# EAGLE design Controlador de temperatura (EAGLE 9.6.2)
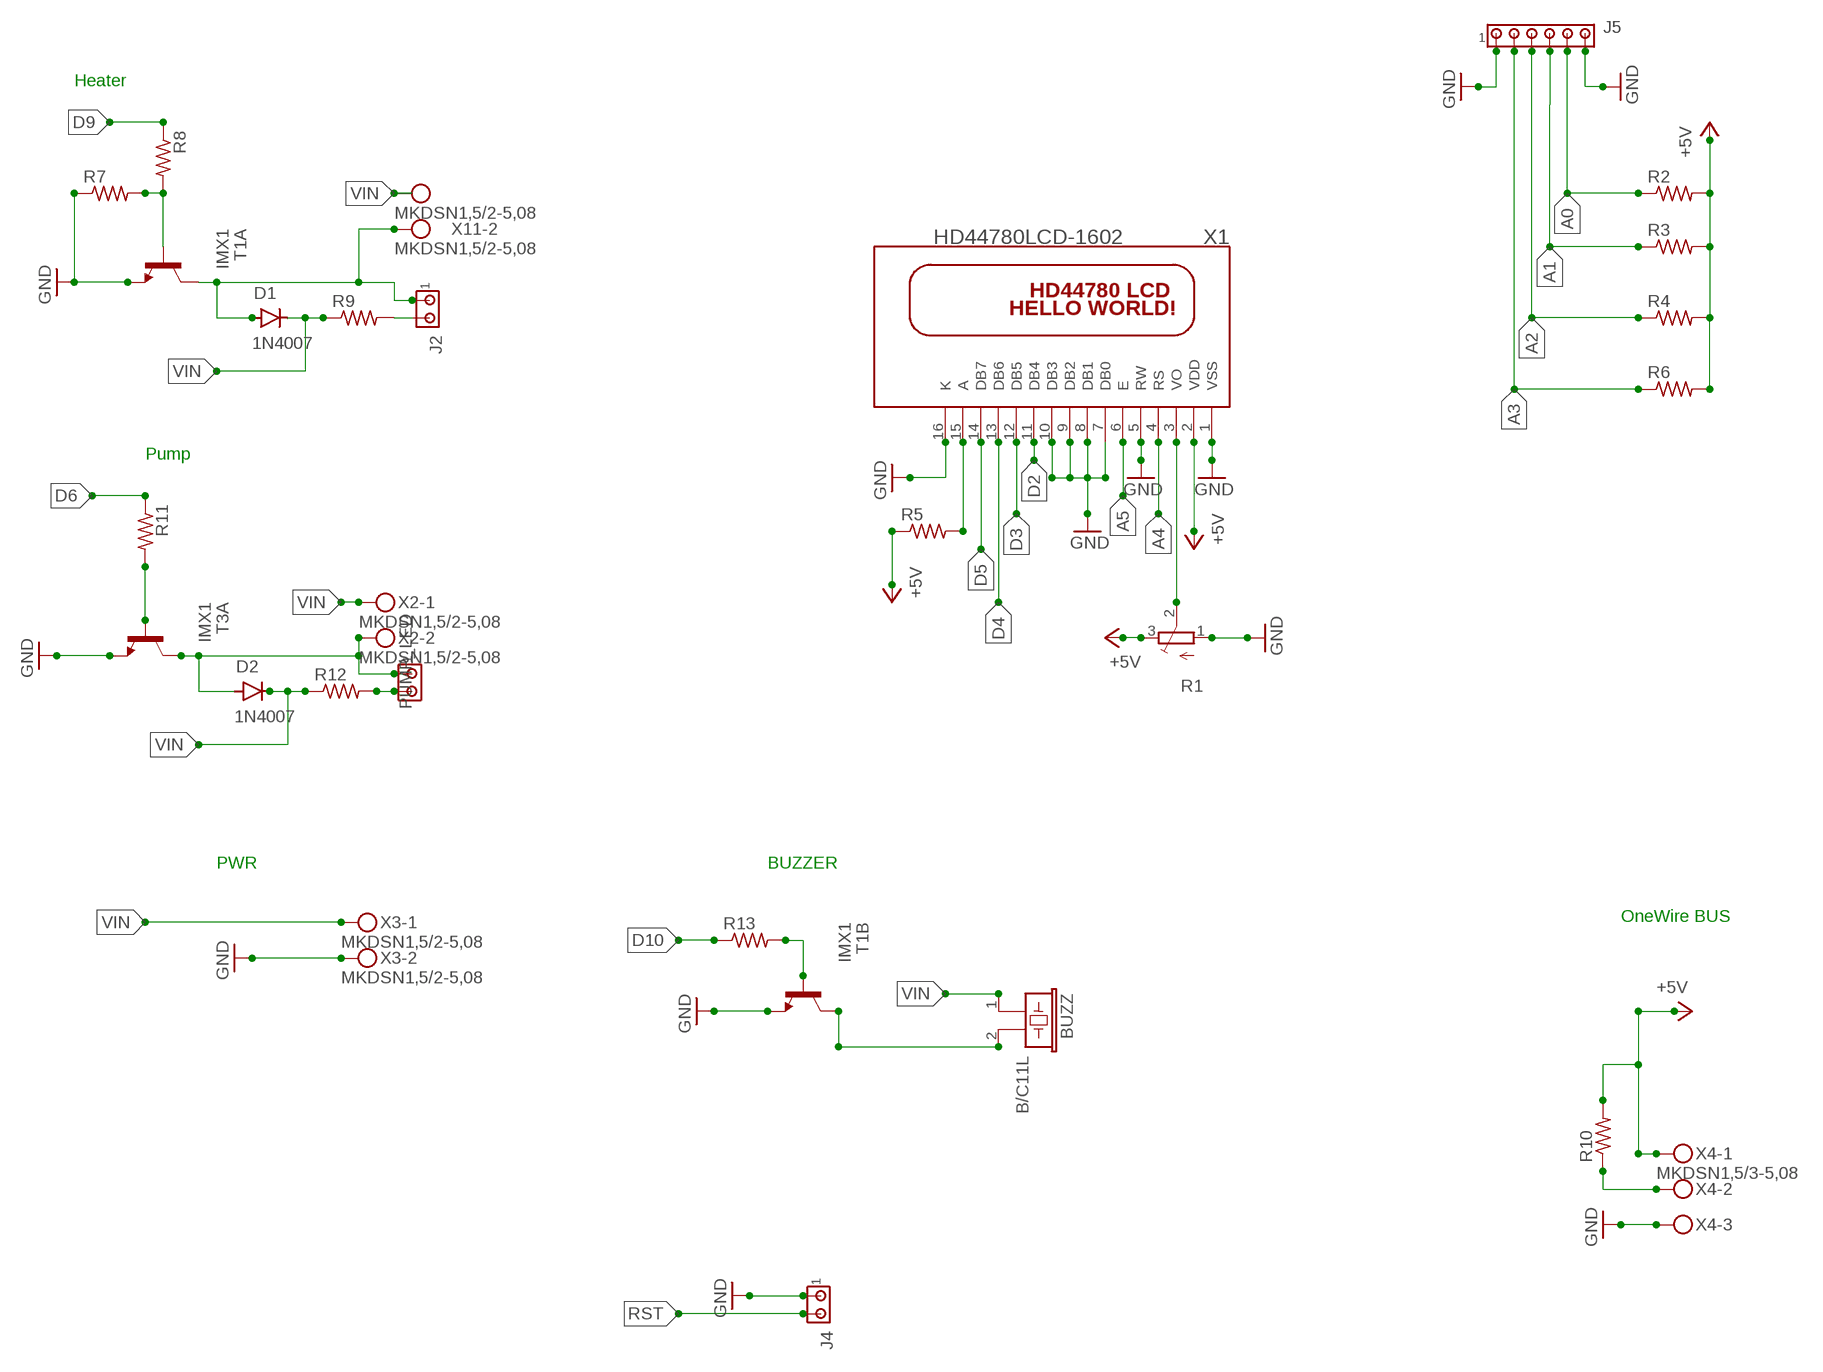
[diagram p0: schematic, sheet 1]

## Parts
BUZZ  B/C11L  [B/C11L]
D1  1N4007  [DO-41]
D2  1N4007  [DO-41]
J2  MTA02-156  [1X2MTA]
J4  MTA02-156  [1X2MTA]
J5  MTA06-100  [10X06MTA]
PUMP_LED  MTA02-156  [1X2MTA]
R1  TRIM_EU-3223W  [3223W]
R2  R-US_0204/7  [0204/7]
R3  R-US_0204/7  [0204/7]
R4  R-US_0204/7  [0204/7]
R5  R-US_0204/7  [0204/7]
R6  R-US_0204/7  [0204/7]
R7  R-US_0204/7  [0204/7]
R8  R-US_0204/7  [0204/7]
R9  R-US_0204/7  [0204/7]
R10  R-US_0204/7  [0204/7]
R11  R-US_0204/7  [0204/7]
R12  R-US_0204/7  [0204/7]
R13  R-US_0204/7  [0204/7]
T1  IMX1  [SMT6]
T3  IMX1  [SMT6]
X1  HD44780LCD-1602  [LCD1602]
X2  MKDSN1,5/2-5,08  [MKDSN1,5/2-5,08]
X3  MKDSN1,5/2-5,08  [MKDSN1,5/2-5,08]
X4  MKDSN1,5/3-5,08  [MKDSN1,5/3-5,08]
X11  MKDSN1,5/2-5,08  [MKDSN1,5/2-5,08]

## Nets
+5V: R1.3(E) R2.2 R3.2 R4.2 R5.1 R6.2 R10.2 X1.2(VDD) X4.1
A0: J5.5 R2.1
A1: J5.4 R3.1
A2: J5.3 R4.1
A3: J5.2 R6.1
A4: X1.4(RS)
A5: X1.6(E)
D2: X1.11(DB4)
D3: X1.12(DB5)
D4: X1.13(DB6)
D5: X1.14(DB7)
D6: R11.1
D9: R8.1
D10: R13.1
GND: J4.1 J5.1 J5.6 R1.1(A) R7.1 T1.3(B:E) T1.6(A:E) T3.6(A:E) X1.1(VSS) X1.5(RW) X1.7(DB0) X1.8(DB1) X1.9(DB2) X1.10(DB3) X1.16(K) X3.2 X4.3
N$1: R5.2 X1.15(A)
N$2: BUZZ.2 T1.4(B:C)
N$8: R1.2(S) X1.3(VO)
N$13: D1.A J2.1 T1.1(A:C) X11.2
N$14: R7.2 R8.2 T1.5(A:B)
N$17: D2.A PUMP_LED.1 T3.1(A:C) X2.2
N$18: R11.2 T3.5(A:B)
N$19: J2.2 R9.2
N$20: PUMP_LED.2 R12.2
N$22: R10.1 X4.2
N$24: R13.2 T1.2(B:B)
RST: J4.2
VIN: BUZZ.1 D1.C D2.C R9.1 R12.1 X2.1 X3.1 X11.1
Unconnected: T3.2(B:B) T3.3(B:E) T3.4(B:C)

## Notes on the sheet
- Heater
- Pump
- PWR | BUZZER
- OneWire BUS

## Library data of the parts
BUZZ = buzzer:B/C11L: BUZZER Source: Buerklin; OC_FARNELL: unknown; OC_NEWARK: unknown
D1 D2 = Diodes:1N4007: DIODE GEN PURP 1KV 1A DO41 Manufacturer's datasheet <https://www.mccsemi.com/pdf/Products/1N4001-1N4007(DO-41).pdf>; CREATED_BY: PCBLayout.com; DIGIKEY_PART_NUMBER: 1N4007MSCT-ND; MANUFACTURER: Micro Commercial Co; MPN: 1N4007; PACKAGE: DO-41
J2 J4 PUMP_LED = con-amp:MTA02-156: AMP connector
J5 = con-amp:MTA06-100: AMP connector Connection corrected 2014-09-19
R1 = pot:TRIM_EU-: POTENTIOMETER
R2-R13 = rcl:R-US_: RESISTOR, American symbol; SPICEPREFIX: R
T1 T3 = rohm:IMX1: General purpose transistors (dual transistors) Two 2SC2412K chips in a EMT or UMT or SMT package. Source: http://www.rohm.com/products/databook/tr/pdf/umx1n.pdf; MPN: IMX1T110; OC_FARNELL: 1680348; OC_NEWARK: 74M2434
X1 = adafruit:HD44780LCD: HD44780 LCD Standard character type LCDs, available in sizes from 8x1 to 40x4!
X2 X3 X11 = con-phoenix-508:MKDSN1,5/2-5,08: MKDSN 1,5/ 2-5,08 Printklemme Nennstrom: 13,5 A Nennspannung: 250 V Rastermaß: 5,08 mm Polzahl: 2 Anschlussart: Schraubanschluss Montage: Löten Anschlussrichtung Leiter/Platine: 0 ° Artikelnummer: 1729128 Source: http://eshop.phoenixcontact.com .. 1729128.pdf
X4 = con-phoenix-508:MKDSN1,5/3-5,08: MKDSN 1,5/ 3-5,08 Printklemme Nennstrom: 13,5 A Nennspannung: 250 V Rastermaß: 5,08 mm Polzahl: 3 Anschlussart: Schraubanschluss Montage: Löten Anschlussrichtung Leiter/Platine: 0 ° Artikelnummer: 1729131 Source: http://eshop.phoenixcontact.com .. 1729131.pdf

## Board
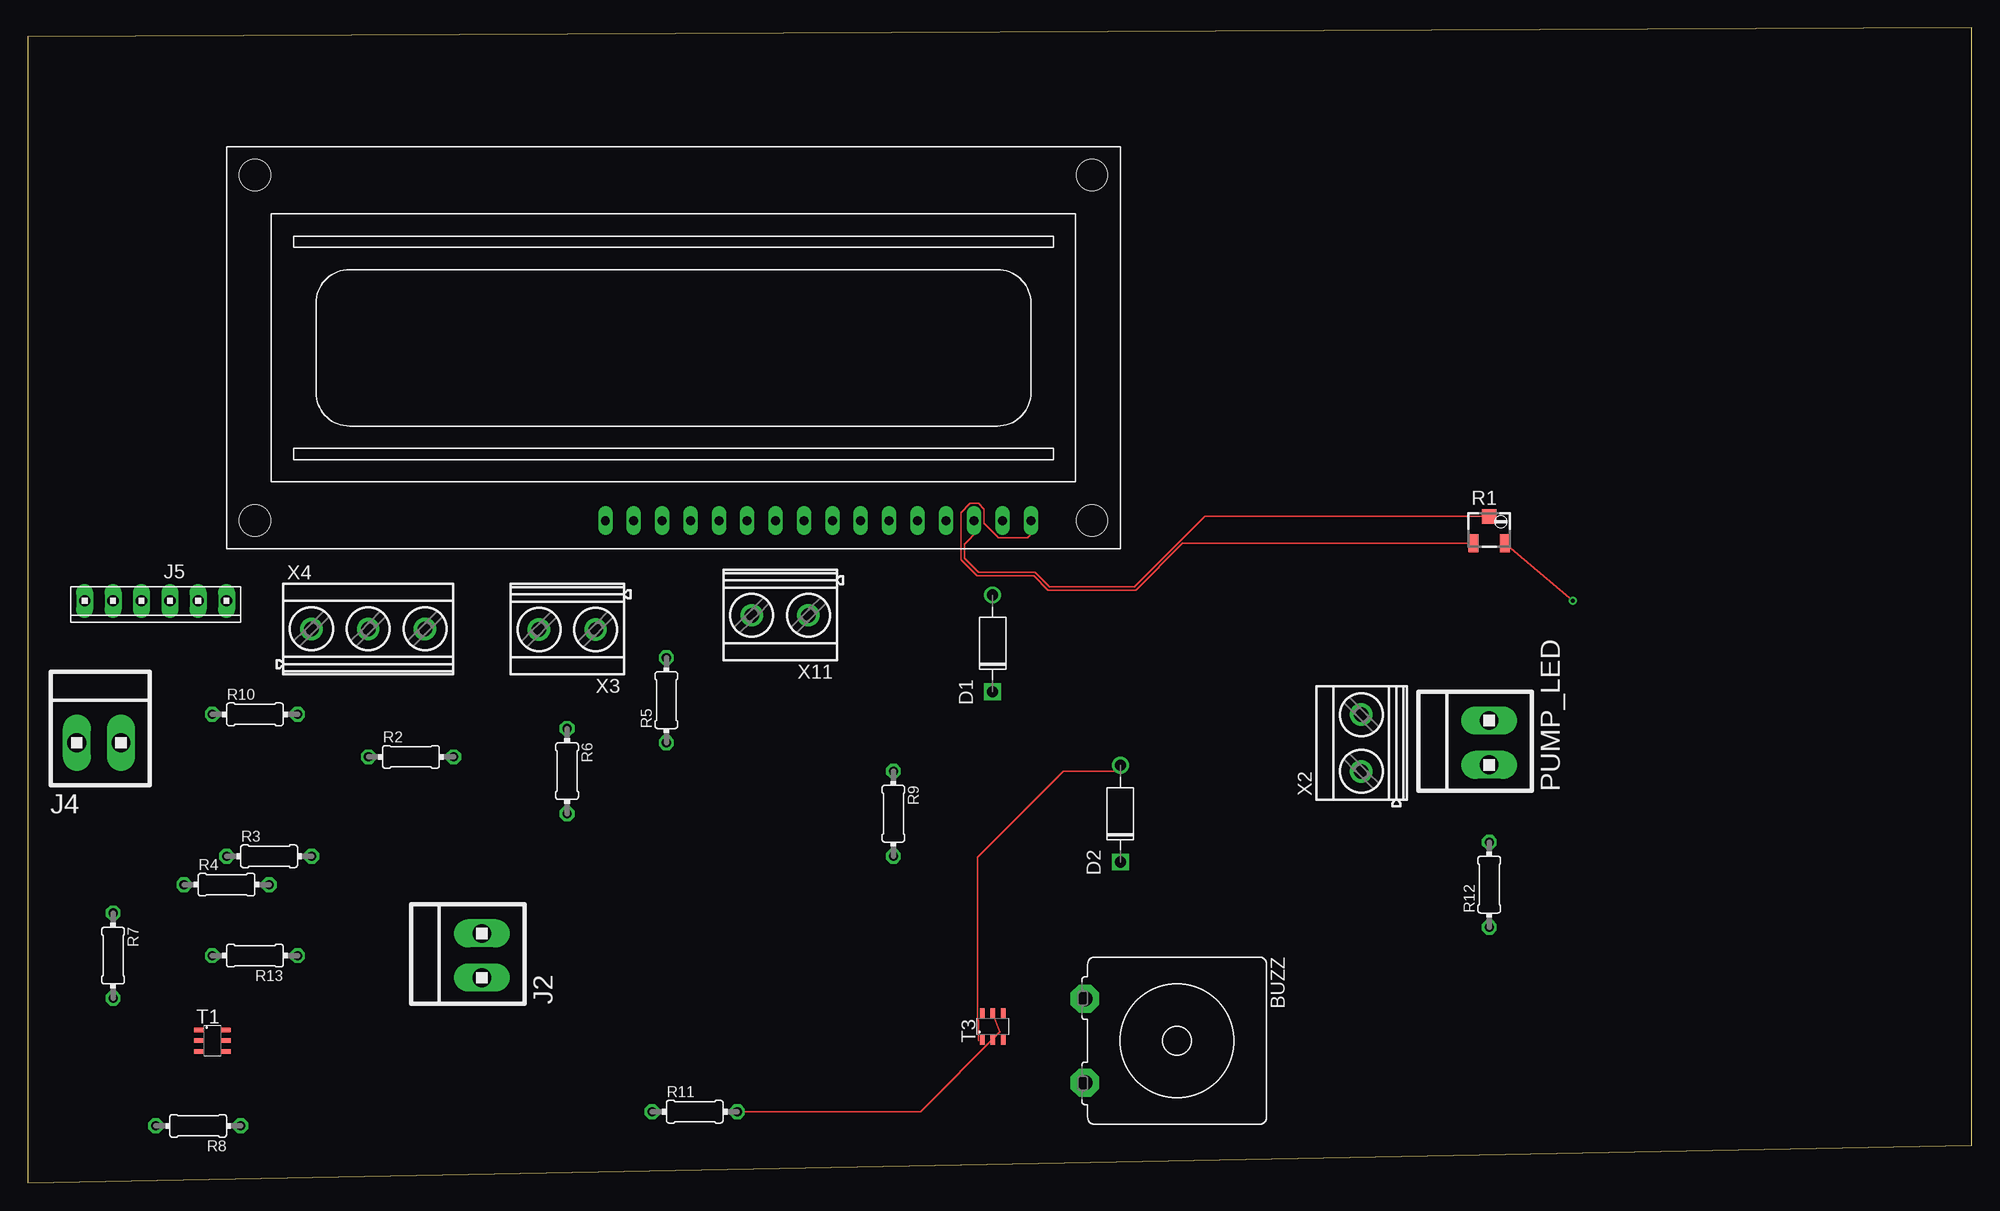
[diagram p1: board, top side]
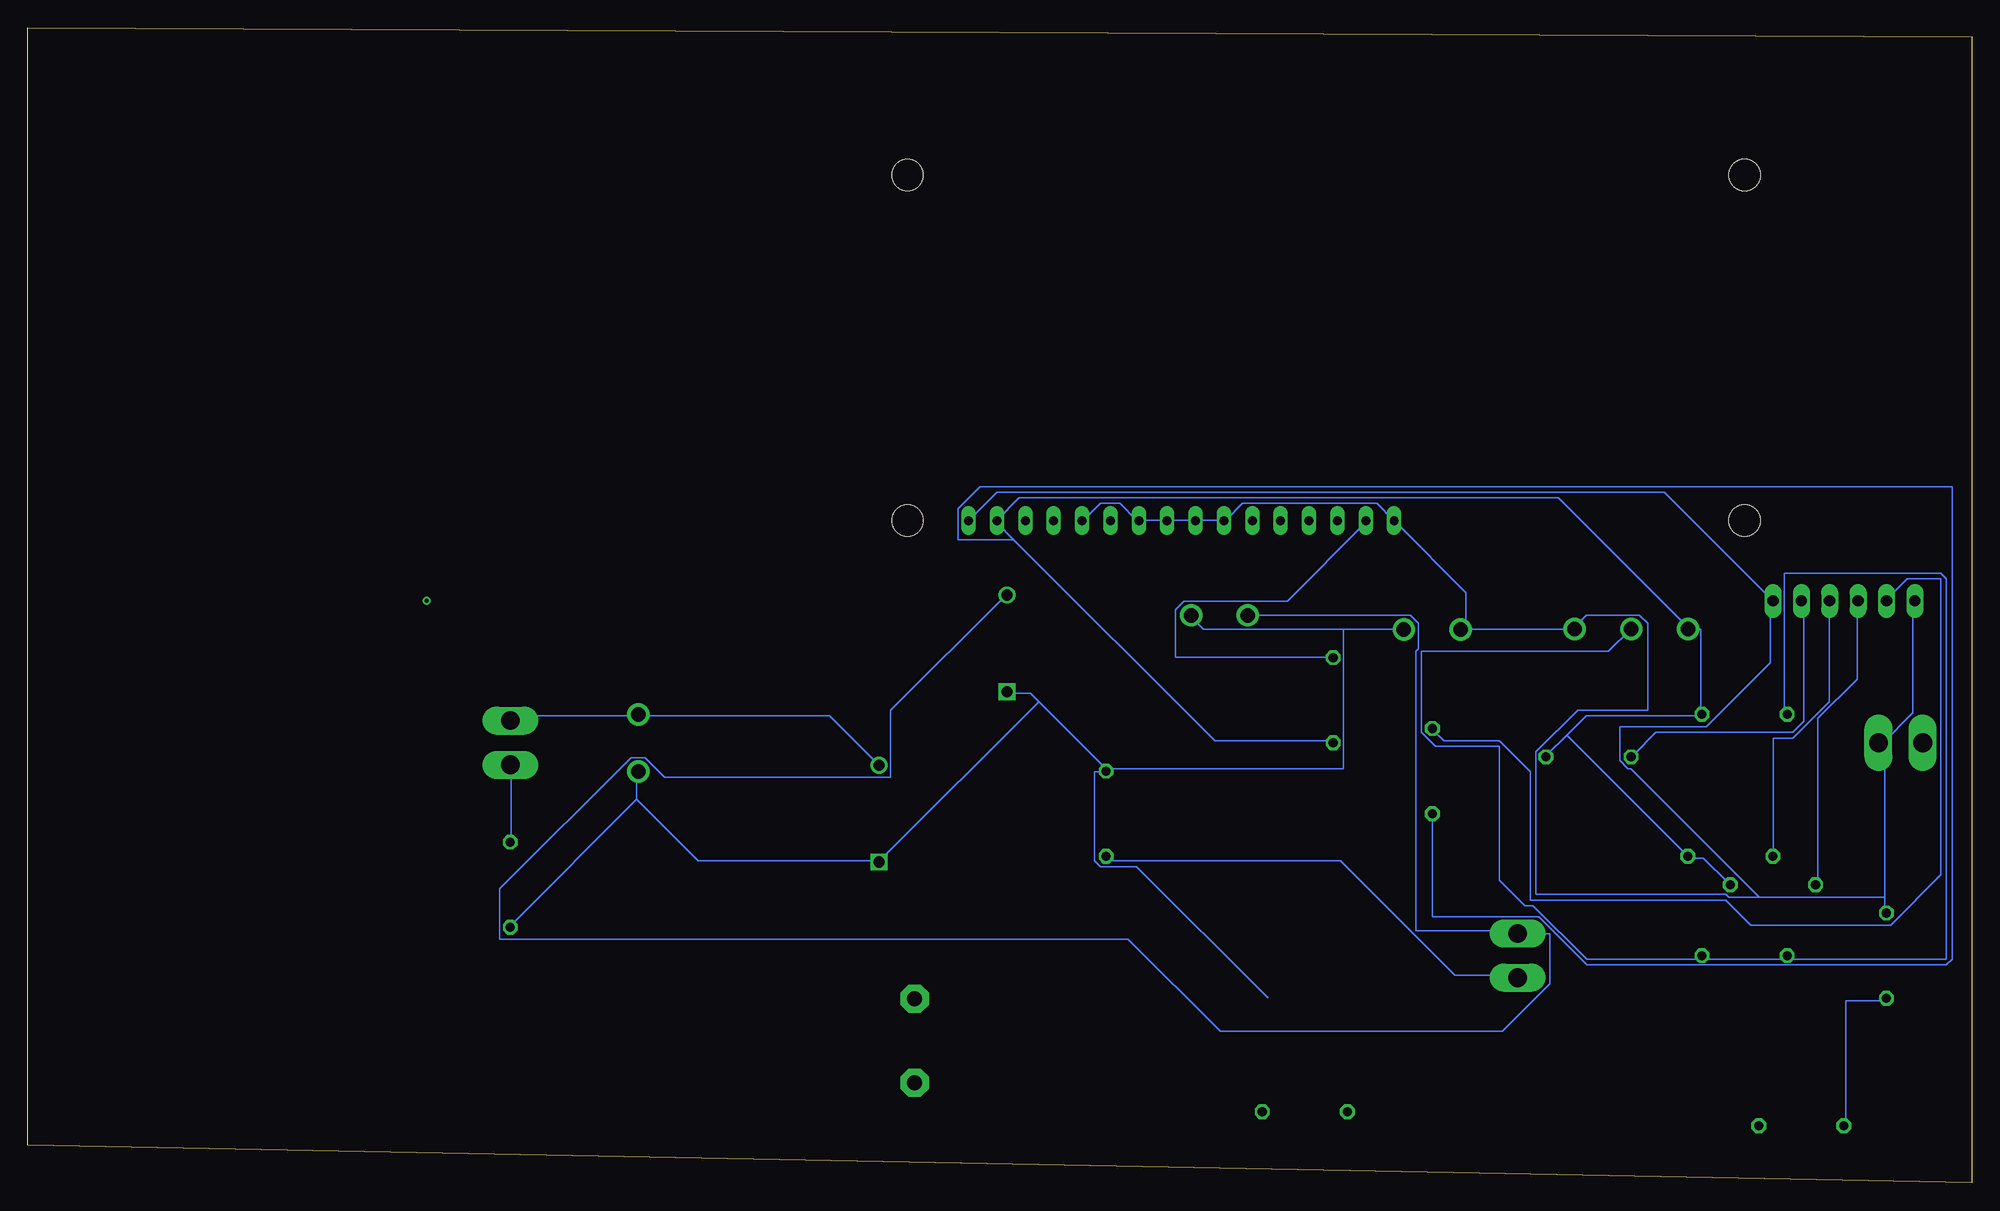
[diagram p2: board, bottom side, seen from below]

Size 173.99 x 103.34 mm. Coordinates in mm from the lower left corner, seen from the top.
Outline: 0,0 173.99,3.34 173.99,103.34 0,102.54 0,0
Copper layers (1*16): Top 0.035mm / dielectric 1.5mm / Bottom 0.035mm
Design rules "default": minimum track width 6mil, minimum drill 0.35mm, track to track 6mil, track to pad 6mil, pad to pad 6mil, via to via 6mil, smd to smd 6mil, copper to edge 40mil, drill to drill 6mil, minimum pad ring 10mil, minimum via ring 8mil, stop-mask expansion 4mil, vias tented up to drill 0mil, thermal gap 10mil

### Footprints (pad centres in the part's own frame; a part is rotated, then mirrored left to right if it is on the bottom)
B/C11L = drill 1.321 pad 2.54 octagon: 1 -3.759,-8.255; 2 3.759,-8.255
DO-41 = drill 1: A 4.325,0 | drill 1 square: C -4.325,0
1X2MTA = drill 1.676 long: 1 1.981,0; 2 -1.981,0
10X06MTA = drill 1.016 long: 1 6.35,0; 2 3.81,0; 3 1.27,0; 4 -1.27,0; 5 -3.81,0; 6 -6.35,0
3223W = smd 0.9 x 1.6: 1 -1.4,-1.215; 3 1.4,-1.215 | smd 1.3 x 1.3: 2 0,1.215
0204/7 = drill 0.813 octagon: 1 -3.81,0; 2 3.81,0
SMT6 = smd 0.9 x 0.4: 1 -1.175,0.95; 2 -1.175,0; 3 -1.175,-0.95; 4 1.175,-0.95; 5 1.175,0; 6 1.175,0.95
LCD1602 = drill 0.8 long: 1 8,33.46; 2 10.54,33.46; 3 13.08,33.46; 4 15.62,33.46; 5 18.16,33.46; 6 20.7,33.46; 7 23.24,33.46; 8 25.78,33.46; 9 28.32,33.46; 10 30.86,33.46; 11 33.4,33.46; 12 35.94,33.46; 13 38.48,33.46; 14 41.02,33.46; 15 43.56,33.46; 16 46.1,33.46 | hole 2.8: 2.54,2.54; 2.54,33.46; 77.46,33.46; 77.46,2.54
MKDSN1,5/2-5,08 = drill 1.3 pad 2: 1 -2.561,0.025; 2 2.519,0.025
MKDSN1,5/3-5,08 = drill 1.3 pad 2: 1 -7.641,0.025; 2 -2.561,0.025; 3 2.519,0.025

### Placement (x,y rotation side)
BUZZ  102.87,12.7 270 top
D1  86.36,48.26 90 top
D2  97.79,33.02 90 top
J2  40.64,20.32 90 top
J4  6.35,39.37 0 top
J5  11.43,52.07 180 top
PUMP_LED  130.81,39.37 90 top
R1  130.81,58.42 0 top
R2  34.29,38.1 0 top
R3  21.59,29.21 0 top
R4  17.78,26.67 0 top
R5  57.15,43.18 90 top
R6  48.26,36.83 270 top
R7  7.62,20.32 270 top
R8  15.24,5.08 180 top
R9  77.47,33.02 270 top
R10  20.32,41.91 0 top
R11  59.69,6.35 0 top
R12  130.81,26.67 90 top
R13  20.32,20.32 180 top
T1  16.51,12.7 0 top
T3  86.36,13.97 90 top
X1  97.79,92.71 180 top
X2  119.38,39.37 90 top
X3  48.26,49.53 180 top
X4  33.02,49.53 0 top
X11  67.31,50.8 180 top

### Tracks (layer width: path | path; a pad name or v marks a point on that pad's centre or on a via)
+5V  (via drill 0.35)
  Top 0.152: R1.3 v138.3,52.08
  Bottom 0.152: R4.2 21.75,26.79 24,29.04 25.25,29.04 R3.2 25.5,29.29 36.25,40.04 | 36.25,40.04 34.5,41.79 24.25,41.79 R10.2 24.25,42.04 24.25,49.54 25.25,49.54 X4.1 25.5,49.79 37,61.29 85.25,61.29 87.25,59.29 X1.2 87.25,59.04 85.75,57.54 | 36.25,40.04 38,38.29 R2.2 | 85.75,57.54 67.75,39.54 57.25,39.54 R5.1 | 85.75,57.54 90.75,57.54 90.75,60.29 88.75,62.29 1.75,62.29 1.75,20 2.25,19.5 34.46,19.5 38.75,23.79 48.25,23.79 48.25,32.79 R6.2
A0
  Bottom 0.152: R2.1 30.25,38.29 28.25,40.29 16,40.29 15,41.29 15,52.04 J5.5
A1
  Bottom 0.152: R3.1 17.75,29.29 17.75,39.79 16,39.79 12.75,43.04 12.75,52.04 J5.4
A2
  Bottom 0.152: R4.1 13.75,26.79 13.75,41.54 10.25,45.04 10.25,52.04 J5.3
A3
  Bottom 0.152: R6.1 48.25,40.54 47.25,39.54 42.25,39.54 39.5,36.79 39.5,25.29 22,25.29 19.75,23.04 7.25,23.04 2.75,27.54 2.75,54.04 5.75,54.04 7.5,52.29 J5.2
GND
  Top 0.152: R1.1 103.36,57.2 99.19,53.03 91.31,53.03 90.04,54.3 84.96,54.3 83.52,55.75 83.52,59.96 84.34,60.79 85.08,60.79 85.59,60.27 85.59,59.01 86.88,57.71 89.46,57.71 90.17,58.42
  Bottom 0.152: X1.5 79.5,59.29 78,60.79 76.25,60.79 74.75,59.29 X1.7 74.5,59.29 72.25,59.29 X1.8 72,59.29 69.5,59.29 X1.9 69.25,59.29 67,59.29 X1.10 66.75,59.29 65.25,60.79 53.25,60.79 51.75,59.29 X1.16 51.5,59.04 45.25,52.79 45.25,49.54 | 45.25,49.54 45.5,49.54 X3.2 45.25,49.54 | 45.25,49.54 35.75,49.54 X4.3 35.5,49.79 34.5,50.79 29.75,50.79 29,50.04 29,42.29 35.25,42.29 39,38.54 39,25.79 22,25.79 21.75,25.54 19,25.54 | 7.75,25.54 7.75,39.29 8,39.29 | 7.75,25.54 7.75,24.29 R7.1 | 8,39.29 8.25,39.29 J4.1 8,39.29 | 8,39.29 5.25,42.04 5.25,52.04 J5.1 | X1.1 87.25,61.79 27.5,61.79 J5.6 18,52.04 18,46.54 23.75,40.79 31.5,40.79 31.5,37.79 30.75,37.04 30.5,37.04 19,25.54 | 19,25.54 7.75,25.54
N$1
  Bottom 0.152: X1.15 54.25,59.04 61.25,52.04 70.5,52.04 71.25,51.29 71.25,47.04 57.25,47.04 R5.2
N$8
  Top 0.152: R1.2 105.36,59.63 99.06,53.34 91.44,53.34 90.17,54.61 85.09,54.61 83.82,55.88 83.82,57.15 85.09,58.42
N$13
  Bottom 0.152: D1.A 86.5,52.54 96.75,42.29 96.75,36.29 117,36.29 118.75,38.04 120,38.04 131.75,26.29 131.75,21.79 75.5,21.79 67.25,13.54 42,13.54 37.75,17.79 37.75,22.29 40.5,22.29 J2.1 40.75,22.54 49.75,22.54 49.75,47.54 49.5,47.79 49.5,50.04 50.25,50.79 64.75,50.79 X11.2
N$14
  Bottom 0.152: R8.2 11.25,5.29 11.25,16.29 7.75,16.29 R7.2
N$17
  Top 0.152: D2.A 97.28,36.83 92.71,36.83 84.98,29.1 84.98,14.6 85.09,14.49 85.09,12.7
  Bottom 0.152: D2.A 98,37.54 102.25,41.79 119.25,41.79 X2.2 119.5,41.79 130.5,41.79 130.75,41.54 PUMP_LED.1
N$18
  Top 0.152: T3.5 87.01,13.45 86.99,13.45 79.89,6.35 62.23,6.35
N$19
  Bottom 0.152: R9.2 77.25,29.04 77,28.79 56.5,28.79 46.25,18.54 40.75,18.54 J2.2
N$20
  Bottom 0.152: R12.2 130.75,30.54 130.75,37.29 PUMP_LED.2
N$22
  Bottom 0.152: R10.1 16.75,42.04 16.75,54.54 2.75,54.54 2.25,54.04 2.25,20 34.46,20 39.25,24.79 40,24.79 42.25,27.04 42.25,39.04 48,39.04 49.25,40.29 49.25,47.54 32.5,47.54 30.5,49.54 X4.2
VIN
  Bottom 0.152: 119.5,34.29 130.75,23.04 R12.1 | 119.5,34.29 119.5,36.79 X2.1 | 56.25,49.54 68.75,49.54 69.75,50.54 X11.1 | 56.25,49.54 51,49.54 X3.1 | 83.5,43.04 84.25,43.79 86.25,43.79 D1.C | 83.5,43.04 77.5,37.04 R9.1 | 83.5,43.04 97.75,28.79 D2.C 98,28.79 114,28.79 119.5,34.29 | 63,16.54 74.75,28.29 78,28.29 78.5,28.79 78.5,36.79 77.5,36.79 R9.1 | 56.25,49.54 56.25,37.04 77.25,37.04 R9.1